# EAGLE design placa (EAGLE 9.6.2)
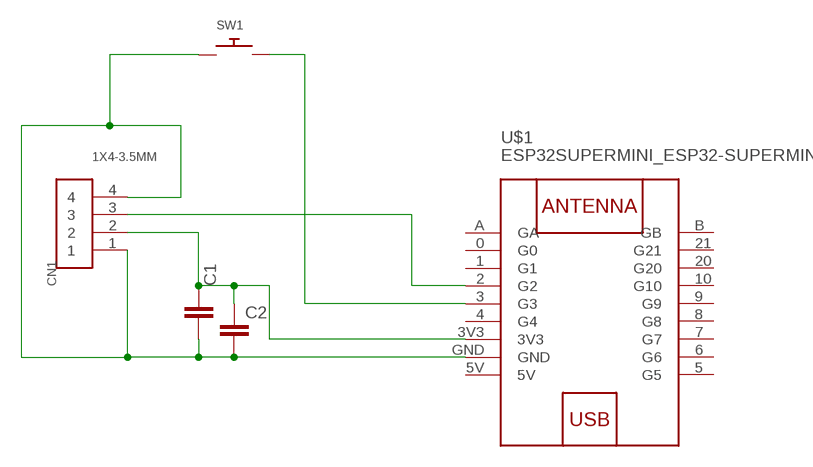
[diagram p0: schematic, sheet 1]

## Parts
C1  C  (no package)
C2  C-EU025-024X044  [C025-024X044]
CN1  1X4-3.5MM  [1X04-3.5MM]
SW1  SWITCH_PUSHBUTTONEVQ-PE  [TACT_PANA-EVQ]
U$1  ESP32SUPERMINI_ESP32-SUPERMINI  [ESP32SUPERMINI_ESP32-SUPERMINI]

## Nets
N$1: C1.2 C2.2 CN1.1 CN1.4 SW1.P$1 U$1.GND
N$2: C1.1 C2.1 CN1.2 U$1.3V3
N$3: CN1.3 U$1.2(G2)
N$5: SW1.P$2 U$1.3(G3)
Unconnected: U$1.0(G0) U$1.1(G1) U$1.4(G4) U$1.5(G5) U$1.6(G6) U$1.7(G7) U$1.8(G8) U$1.9(G9) U$1.10(G10) U$1.20(G20) U$1.21(G21) U$1.A(GA) U$1.B(GB)

## Power pins joined to a net without a drawn wire
5V: U$1.5V

## Library data of the parts
C1 = ngspice-simulation:C: CAPACITOR
C2 = rcl:C-EU: CAPACITOR, European symbol; SPICEPREFIX: C
CN1 = adafruit:1X4: 4-pin connector
SW1 = adafruit:SWITCH_PUSHBUTTON: Buttons SOFTTOUCHSMD_SJ - Soft touch temporary push button (Super Junk Akihabara) Compatible with SKPMANE010 [Mouser: 688-SKPMAN] C&K_KSS = Digikey: KSS221GLFS
U$1 = ESP32C3supermini:ESP32SUPERMINI_ESP32-SUPERMINI: WEMOS D1 mini: Mini Wi-Fi Board based on ESP-8266 device More details can be found here: https://www.wemos.cc/product/d1-mini.html Click here to find device on ebay.com <http://www.ebay.com/sch/wemos+d1+mini+nodemcu>

## Board
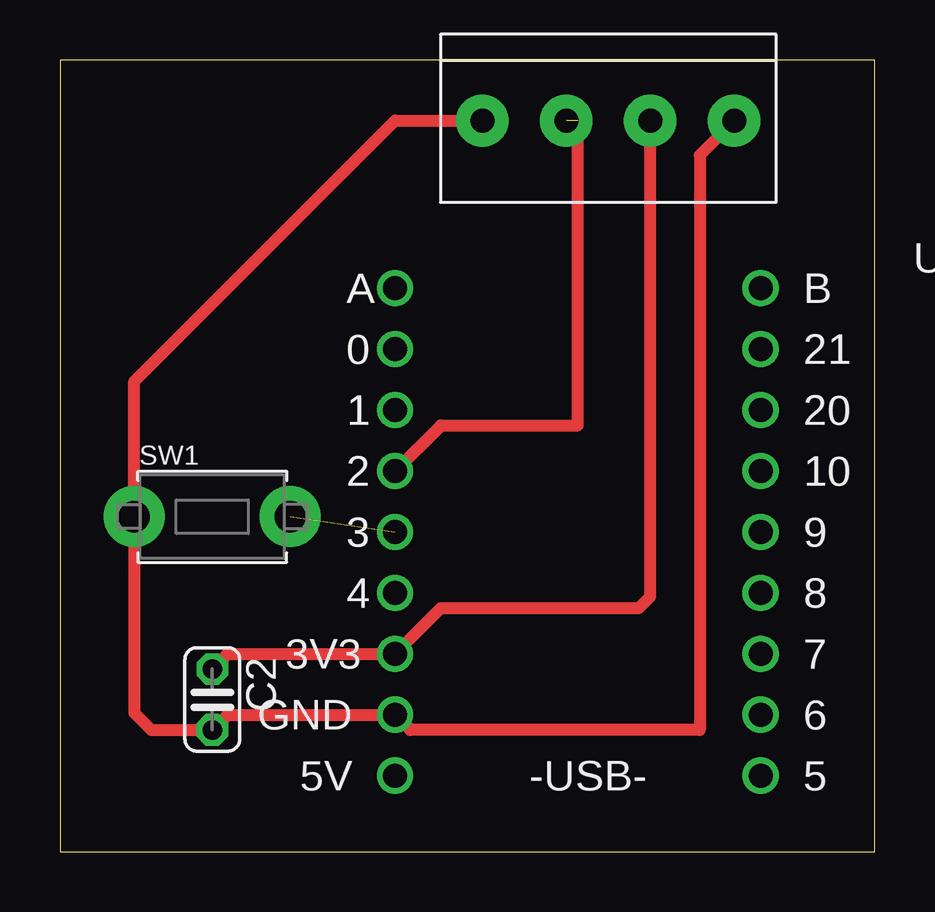
[diagram p1: board, top side]

Size 33.96 x 33.01 mm. Coordinates in mm from the lower left corner, seen from the top.
Outline: 0,0 33.96,0 33.96,33.01 0,33.01 0,0
Copper layers (1*16): Top 0.035mm / dielectric 1.5mm / Bottom 0.035mm
Design rules "default": minimum track width 6mil, minimum drill 0.35mm, track to track 6mil, track to pad 6mil, pad to pad 6mil, via to via 6mil, smd to smd 6mil, copper to edge 40mil, drill to drill 6mil, minimum pad ring 10mil, minimum via ring 8mil, stop-mask expansion 4mil, vias tented up to drill 0mil, thermal gap 10mil

### Footprints (pad centres in the part's own frame; a part is rotated, then mirrored left to right if it is on the bottom)
C025-024X044 = drill 0.813 octagon: 1 -1.27,0; 2 1.27,0
1X04-3.5MM = drill 1 pad 2.184: 1 -5.25,0; 2 -1.75,0; 3 1.75,0; 4 5.25,0
TACT_PANA-EVQ = drill 1.3 pad 2.54: P$1 -3.25,0; P$2 3.25,0
ESP32SUPERMINI_ESP32-SUPERMINI = drill 1: 0 -11.43,9.525; 1 -11.43,6.985; 2 -11.43,4.445; 3 -11.43,1.905; 3V3 -11.43,-3.175; 4 -11.43,-0.635; 5 3.81,-8.255; 5V -11.43,-8.255; 6 3.81,-5.715; 7 3.81,-3.175; 8 3.81,-0.635; 9 3.81,1.905; 10 3.81,4.445; 20 3.81,6.985; 21 3.81,9.525; A -11.43,12.065; B 3.81,12.065; GND -11.43,-5.715

### Placement (x,y rotation side)
C2  6.35,6.35 270 top
CN1  22.86,30.48 180 top
SW1  6.35,13.97 0 top
U$1  25.4,11.43 0 top

### Tracks (layer width: path | path; a pad name or v marks a point on that pad's centre or on a via)
N$1
  Top 0.508: 17.22,30.1 CN1.4 13.97,30.48 3.1,19.61 SW1.P$1 3.1,5.79 3.81,5.08 C2.2 6.98,5.71 U$1.GND 14.6,5.08 26.67,5.08 26.67,29.04 CN1.1
N$2
  Top 0.508: C2.1 6.98,8.25 U$1.3V3 15.88,10.16 24.13,10.16 24.61,10.64 CN1.2
N$3  (1 unrouted)
  Top 0.508: U$1.2 15.88,17.78 21.59,17.78 21.59,30.48
N$5  (1 unrouted)